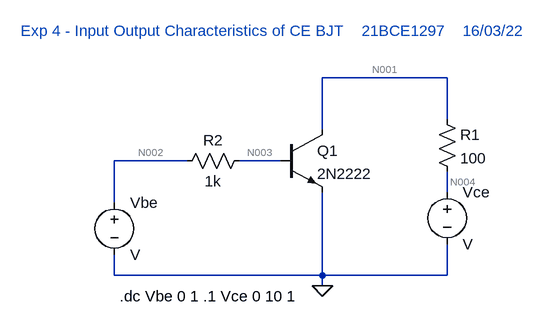
[diagram p0: schematic Exp4.asc]
Exp4.asc, the LTspice schematic file:
Version 4
SHEET 1 880 680
WIRE 416 -80 224 -80
WIRE 416 -16 416 -80
WIRE 224 0 224 -80
WIRE 16 48 -96 48
WIRE 160 48 96 48
WIRE 416 96 416 64
WIRE -96 112 -96 48
WIRE -96 224 -96 192
WIRE 224 224 224 96
WIRE 224 224 -96 224
WIRE 416 224 416 176
WIRE 416 224 224 224
WIRE 224 240 224 224
FLAG 224 240 0
SYMBOL npn 160 0 R0
SYMATTR InstName Q1
SYMATTR Value 2N2222
SYMBOL voltage -96 96 R0
SYMATTR InstName Vbe
SYMBOL voltage 416 80 R0
SYMATTR InstName Vce
SYMBOL res 400 -32 R0
SYMATTR InstName R1
SYMATTR Value 100
SYMBOL res 112 32 R90
WINDOW 0 0 56 VBottom 2
WINDOW 3 32 56 VTop 2
SYMATTR InstName R2
SYMATTR Value 1k
TEXT -88 256 Left 2 !.dc Vbe 0 1 .1 Vce 0 10 1
TEXT -240 -152 Left 2 ;Exp 4 - Input Output Characteristics of CE BJT    21BCE1297    16/03/22

The netlist it stands for:
* Exp4.asc
Q1 N001 N003 0 0 2N2222
Vbe N002 0 V
Vce N004 0 V
R1 N001 N004 100
R2 N003 N002 1k
.model NPN NPN
.model PNP PNP
.lib standard.bjt
.dc Vbe 0 1 .1 Vce 0 10 1
* Exp 4 - Input Output Characteristics of CE BJT    21BCE1297    16/03/22
.backanno
.end

* Results of the author's LTspice run, read from the files saved beside the schematic
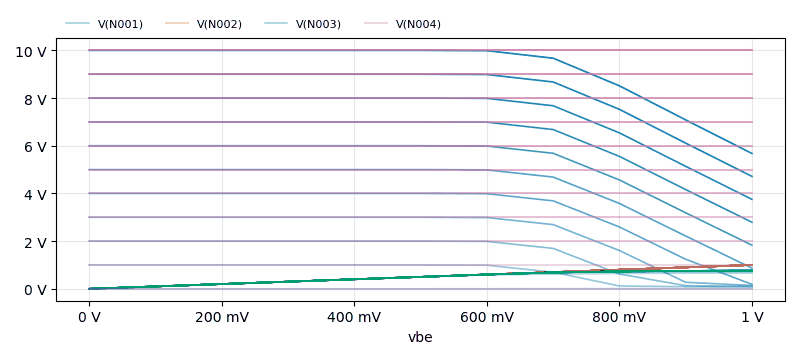
[diagram p1: DC transfer characteristic of Exp4.asc, plotted from the saved traces]
* DC transfer characteristic, 11 runs:
*   V(N001) [vce=0]: 0 V at vbe=0 V, 6.274 mV at vbe=1 V, min 0 V, max 6.274 mV
*   V(N001) [vce=1]: 1 V at vbe=0 V, 75.56 mV at vbe=1 V, min 75.56 mV, max 1 V
*   V(N001) [vce=2]: 2 V at vbe=0 V, 107.9 mV at vbe=1 V, min 107.9 mV, max 2 V
*   V(N001) [vce=3]: 3 V at vbe=0 V, 138.6 mV at vbe=1 V, min 138.6 mV, max 3 V
*   V(N001) [vce=4]: 4 V at vbe=0 V, 188.4 mV at vbe=1 V, min 188.4 mV, max 4 V
*   V(N001) [vce=5]: 5 V at vbe=0 V, 869.8 mV at vbe=1 V, min 869.8 mV, max 5 V
*   V(N001) [vce=6]: 6 V at vbe=0 V, 1.831 V at vbe=1 V, min 1.831 V, max 6 V
*   V(N001) [vce=7]: 7 V at vbe=0 V, 2.793 V at vbe=1 V, min 2.793 V, max 7 V
*   V(N002) [vce=0]: 0 V at vbe=0 V, 1 V at vbe=1 V, min 0 V, max 1 V
*   V(N002) [vce=1]: 0 V at vbe=0 V, 1 V at vbe=1 V, min 0 V, max 1 V
*   V(N002) [vce=2]: 0 V at vbe=0 V, 1 V at vbe=1 V, min 0 V, max 1 V
*   V(N002) [vce=3]: 0 V at vbe=0 V, 1 V at vbe=1 V, min 0 V, max 1 V
*   V(N002) [vce=4]: 0 V at vbe=0 V, 1 V at vbe=1 V, min 0 V, max 1 V
*   V(N002) [vce=5]: 0 V at vbe=0 V, 1 V at vbe=1 V, min 0 V, max 1 V
*   V(N002) [vce=6]: 0 V at vbe=0 V, 1 V at vbe=1 V, min 0 V, max 1 V
*   V(N002) [vce=7]: 0 V at vbe=0 V, 1 V at vbe=1 V, min 0 V, max 1 V
*   V(N003) [vce=0]: 0 V at vbe=0 V, 664.4 mV at vbe=1 V, min 0 V, max 664.4 mV
*   V(N003) [vce=1]: 1.003 nV at vbe=0 V, 720.7 mV at vbe=1 V, min 1.003 nV, max 720.7 mV
*   V(N003) [vce=2]: 2.003 nV at vbe=0 V, 740.2 mV at vbe=1 V, min 2.003 nV, max 740.2 mV
*   V(N003) [vce=3]: 3.003 nV at vbe=0 V, 753 mV at vbe=1 V, min 3.003 nV, max 753 mV
*   V(N003) [vce=4]: 4.003 nV at vbe=0 V, 762.6 mV at vbe=1 V, min 4.003 nV, max 762.6 mV
*   V(N003) [vce=5]: 5.003 nV at vbe=0 V, 765.3 mV at vbe=1 V, min 5.003 nV, max 765.3 mV
*   V(N003) [vce=6]: 6.003 nV at vbe=0 V, 765.4 mV at vbe=1 V, min 6.003 nV, max 765.4 mV
*   V(N003) [vce=7]: 7.003 nV at vbe=0 V, 765.5 mV at vbe=1 V, min 7.003 nV, max 765.5 mV
*   V(N004) [vce=0]: 0 V at vbe=0 V, 0 V at vbe=1 V, min 0 V, max 0 V
*   V(N004) [vce=1]: 1 V at vbe=0 V, 1 V at vbe=1 V, min 1 V, max 1 V
*   V(N004) [vce=2]: 2 V at vbe=0 V, 2 V at vbe=1 V, min 2 V, max 2 V
*   V(N004) [vce=3]: 3 V at vbe=0 V, 3 V at vbe=1 V, min 3 V, max 3 V
*   V(N004) [vce=4]: 4 V at vbe=0 V, 4 V at vbe=1 V, min 4 V, max 4 V
*   V(N004) [vce=5]: 5 V at vbe=0 V, 5 V at vbe=1 V, min 5 V, max 5 V
*   V(N004) [vce=6]: 6 V at vbe=0 V, 6 V at vbe=1 V, min 6 V, max 6 V
*   V(N004) [vce=7]: 7 V at vbe=0 V, 7 V at vbe=1 V, min 7 V, max 7 V